# EAGLE design USB_DebugCable (EAGLE 6.4)
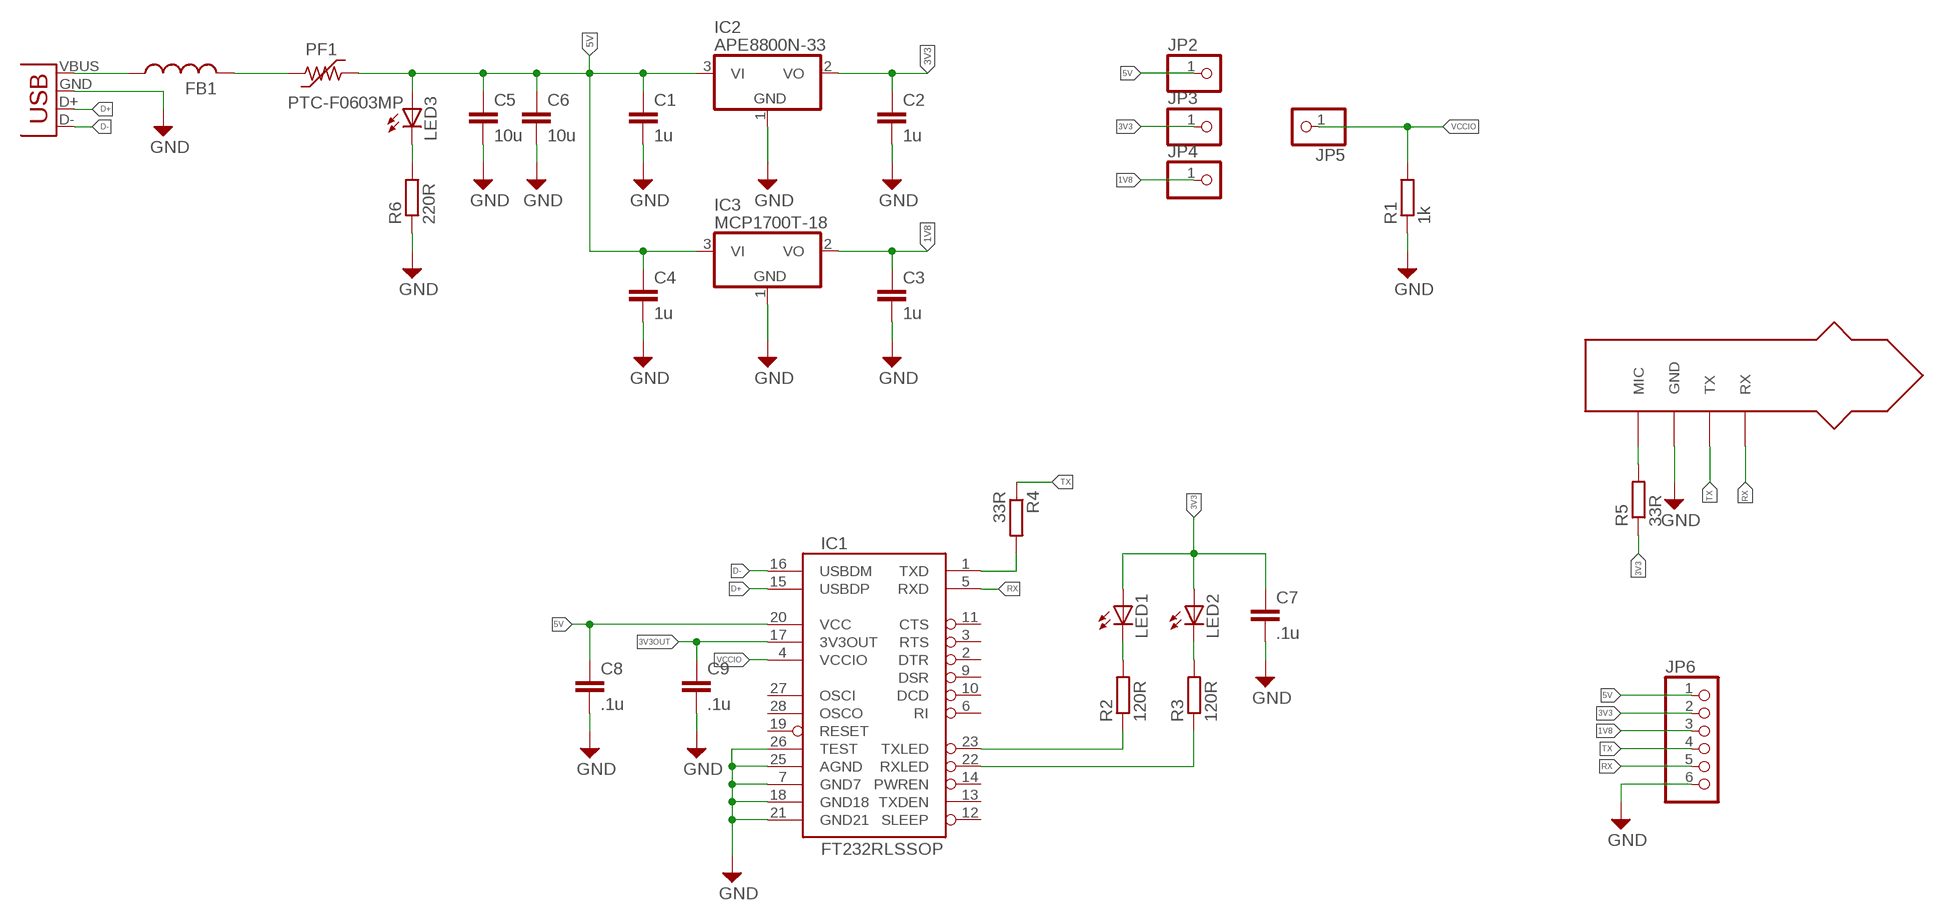
[diagram p0: schematic, sheet 1]

## Parts
C1  1u  C-EUC0603K  [C0603K]
C2  1u  C-EUC0603K  [C0603K]
C3  1u  C-EUC0603K  [C0603K]
C4  1u  C-EUC0603K  [C0603K]
C5  10u  C-EUC0603K  [C0603K]
C6  10u  C-EUC0603K  [C0603K]
C7  .1u  C-EUC0603K  [C0603K]
C8  .1u  C-EUC0402K  [C0402K]
C9  .1u  C-EUC0402K  [C0402K]
FB1  FERRITE-BEADA  [0603]
IC1  FT232RLSSOP  [SSOP28DB]
IC2  APE8800N-33  MCP1703CB  [SOT23]
IC3  MCP1700T-18  MCP1703CB  [SOT23]
JP1  USB-A-H  [USB-A-H]
JP2  PINHD-1X1  [1X01]
JP3  PINHD-1X1  [1X01]
JP4  PINHD-1X1  [1X01]
JP5  PINHD-1X1  [1X01]
JP6  PINHD-1X6CB  [1X06-CLEANBIG]
LED1  LEDCHIPLED_0603  [CHIPLED_0603]
LED2  LEDCHIPLED_0603  [CHIPLED_0603]
LED3  LEDCHIPLED_0603  [CHIPLED_0603]
PF1  PTC-F0603MP  [F0603MP]
R1  1k  R-EU_R0603  [R0603]
R2  120R  R-EU_R0603  [R0603]
R3  120R  R-EU_R0603  [R0603]
R4  33R  R-EU_R0603  [R0603]
R5  33R  R-EU_R0603  [R0603]
R6  220R  R-EU_R0603  [R0603]
U$1  JACK3.5_4  [3.5MM4]

## Nets
1V8: C3.1 IC3.2(VO) JP4.1 JP6.3
3V3: C2.1 C7.1 IC2.2(VO) JP3.1 JP6.2 LED1.A LED2.A R5.1
3V3OUT: C9.1 IC1.17(3V3OUT)
5V: C1.1 C4.1 C5.1 C6.1 C8.1 IC1.20(VCC) IC2.3(VI) IC3.3(VI) JP2.1 JP6.1 LED3.A PF1.2
D+: IC1.15(USBDP) JP1.D+(D-)
D-: IC1.16(USBDM) JP1.D-(D+)
GND: C1.2 C2.2 C3.2 C4.2 C5.2 C6.2 C7.2 C8.2 C9.2 IC1.7(GND7) IC1.18(GND18) IC1.21(GND21) IC1.25(AGND) IC1.26(TEST) IC2.1(GND) IC3.1(GND) JP1.GND(VBUS) JP6.6 R1.1 R6.1 U$1.GND
N$1: FB1.1 JP1.VBUS(GND)
N$2: R5.2 U$1.MIC_1(MIC) U$1.MIC_2(MIC)
N$3: IC1.1(TXD) R4.2
N$4: FB1.2 PF1.1
N$5: IC1.23(TXLED) R2.1
N$6: IC1.22(RXLED) R3.1
N$7: LED1.C R2.2
N$8: LED2.C R3.2
N$9: LED3.C R6.2
RX: IC1.5(RXD) JP6.5 U$1.RX_1(RX) U$1.RX_2(RX)
TX: JP6.4 R4.1 U$1.TX
VCCIO: IC1.4(VCCIO) JP5.1 R1.2
Unconnected: IC1.2(DTR) IC1.3(RTS) IC1.6(RI) IC1.9(DSR) IC1.10(DCD) IC1.11(CTS) IC1.12(SLEEP) IC1.13(TXDEN) IC1.14(PWREN) IC1.19(RESET) IC1.27(OSCI) IC1.28(OSCO)

## Library data of the parts
C1-C9 = rcl-2:C-EU: CAPACITOR, European symbol
FB1 = m-pad-2.1:FERRITE-BEAD: Ferrite beads in various packages
IC1 = SparkFun:FT232RL: USB UART FT232RL 4th Generation USB UART (USB <-> Serial) Controller. Spark Fun Electronics SKU : COM-00650
IC2 IC3 = linear:MCP1703: 250 mA, 16V, Low Quiescent Current LDO Regulator Source: http://ww1.microchip.com/downloads/en/DeviceDoc/22049b.pdf
JP1 = SparkFun-Connectors:USB: USB Connectors USB-B-PTH is fully proven SKU : PRT-00139/CONN-08278 USB-miniB is fully proven SKU : PRT-00587 USB-A-PCB is untested. USB-A-H is throughly reviewed, but untested. Spark Fun Electronics SKU : PRT-00437 USB-B-SMT is throughly reviewed, but untested. Needs silkscreen touching up. USB-A-S has not been used/tested USB-MB-H has not been used/tested USB-MICROB has been used. CONN-09505
JP2-JP5 = adafruit:PINHD-1X1: Pin header 1x1 for 0.1" spacing With round pins
JP6 = adafruit:PINHD-1X6: PIN HEADER
LED1-LED3 = adafruit:LED: LED OSRAM: - CHIPLED LG R971, LG N971, LY N971, LG Q971, LY Q971, LO R971, LY R971 LH N974, LH R974 LS Q976, LO Q976, LY Q976 LO Q996 - Hyper CHIPLED LW Q18S LB Q993, LB Q99A, LB R99A - SideLED LS A670, LO A670, LY A670, LG A670, LP A670 LB A673, LV A673, LT A673, LW A673 LH A674 LY A675 LS A676, LA A676, LO A676, LY A676, LW A676 LS A679, LY A679, LG A679 - Hyper Micro SIDELED® LS Y876, LA Y876, LO Y876, LY Y876 LT Y87S - SmartLED LW L88C, LW L88S LB L89C, LB L89S, LG L890 LS L89K, LO L89K, LY L89K LS L896, LA L896, LO L896, LY L896 - TOPLED LS T670, LO T670, LY T670, LG T670, LP T670 LSG T670, LSP T670, LSY T670, LOP T670, LYG T670 LG T671, LOG T671, LSG T671 LB T673, LV T673, LT T673, LW T673 LH T674 LS T676, LA T676, LO T676, LY T676, LB T676, LH T676, LSB T676, LW T676 LB T67C, LV T67C, LT T67C, LS T67K, LO T67K, LY T67K, LW E67C LS E67B, LA E67B, LO E67B, LY E67B, LB E67C, LV E67C, LT E67C LW T67C LS T679, LY T679, LG T679 LS T770, LO T770, LY T770, LG T770, LP T770 LB T773, LV T773, LT T773, LW T773 LH T774 LS E675, LA E675, LY E675, LS T675 LS T776, LA T776, LO T776, LY T776, LB T776 LHGB T686 LT T68C, LB T68C - Hyper Mini TOPLED® LB M676 - Mini TOPLED Santana® LG M470 LS M47K, LO M47K, LY M47K Source: http://www.osram.convergy.de/
PF1 = polyswitch:PTC-: POLYSWITCH Polyswitch Resetable Fuses
R1-R6 = rcl-2:R-EU_: RESISTOR, European symbol
U$1 = jack_35_4:JACK3.5_4

## Board
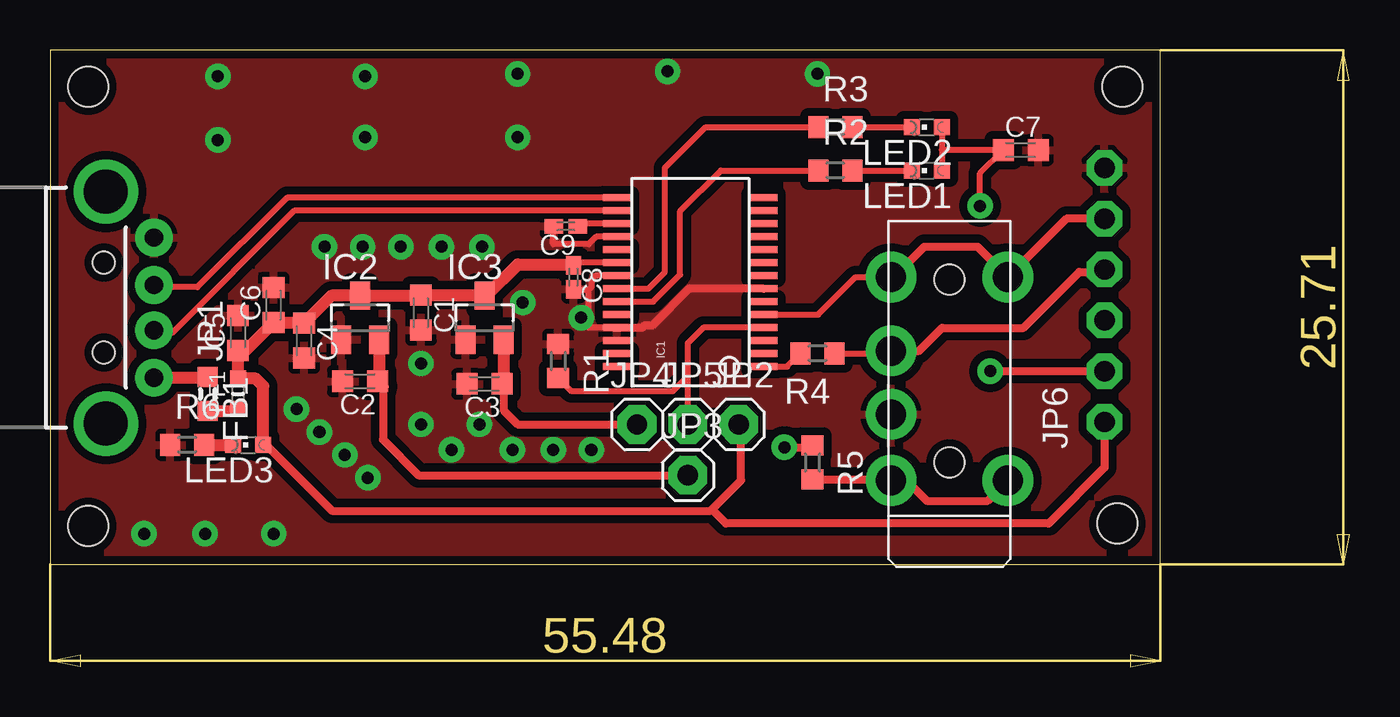
[diagram p1: board, top side]
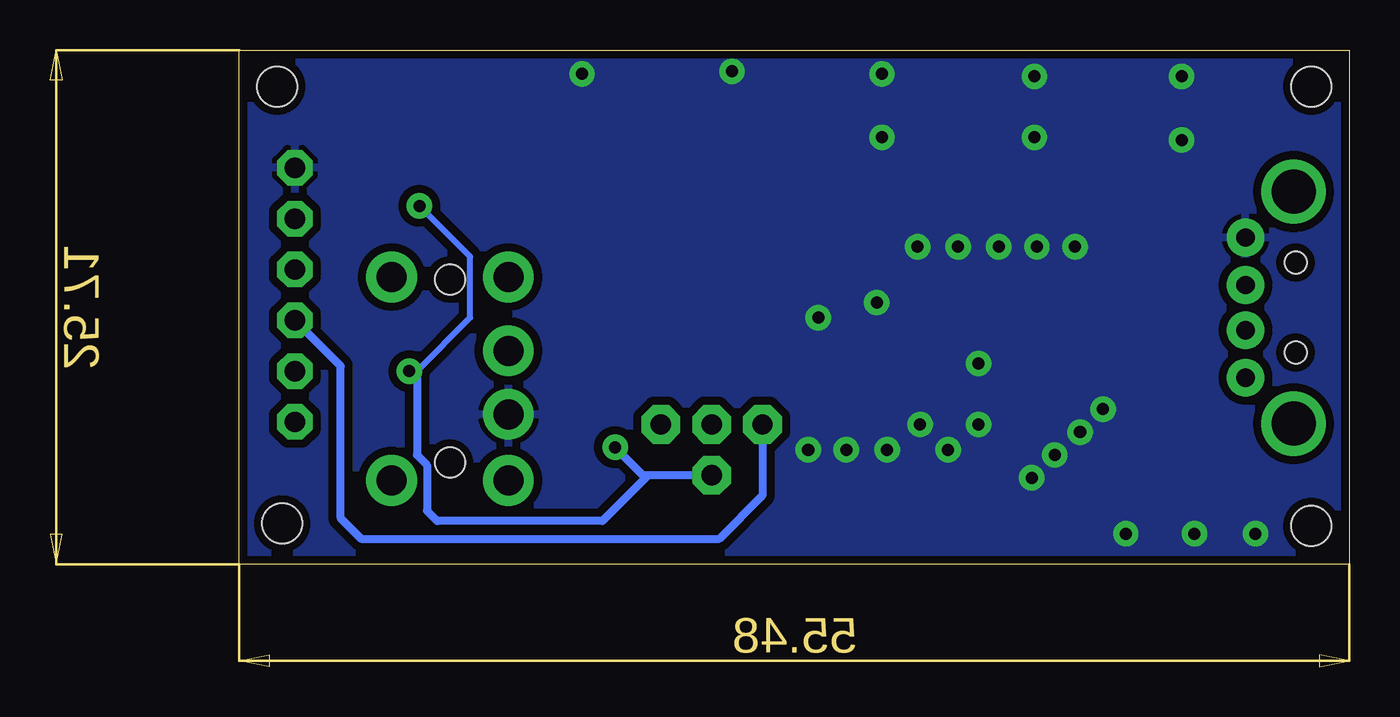
[diagram p2: board, bottom side, seen from below]

Size 55.48 x 25.71 mm. Coordinates in mm from the lower left corner, seen from the top.
Outline: 0,0 55.48,0 55.48,25.71 0,25.71 0,0
Copper layers (1*16): Top 0.0356mm / dielectric 1.5011mm / Bottom 0.0356mm
Design rules "InGear": minimum track width 10mil, minimum drill 0.5mm, track to track 10mil, track to pad 10mil, pad to pad 10mil, via to via 12mil, smd to smd 0mil, copper to edge 15mil, drill to drill 15mil, minimum pad ring 7mil, minimum via ring 7mil, stop-mask expansion 4mil, vias tented up to drill 0mil, thermal gap 10mil
Holes 2 mm at 1.91,23.88 53.59,23.88 53.34,2.03 1.91,1.91

### Footprints (pad centres in the part's own frame; a part is rotated, then mirrored left to right if it is on the bottom)
C0603K = smd 1.05 x 1.08: 1 -0.875,0; 2 0.875,0
C0402K = smd 0.925 x 0.74: 1 -0.6,0; 2 0.6,0
0603 = smd 1 x 1: 1 -0.85,0; 2 0.85,0
SSOP28DB = smd 0.348 x 1.397: 1 -4.225,-3.656; 2 -3.575,-3.656; 3 -2.925,-3.656; 4 -2.275,-3.656; 5 -1.625,-3.656; 6 -0.975,-3.656; 7 -0.325,-3.656; 8 0.325,-3.656; 9 0.975,-3.656; 10 1.625,-3.656; 11 2.275,-3.656; 12 2.925,-3.656; 13 3.575,-3.656; 14 4.225,-3.656; 15 4.225,3.656; 16 3.575,3.656; 17 2.925,3.656; 18 2.275,3.656; 19 1.625,3.656; 20 0.975,3.656; 21 0.325,3.656; 22 -0.325,3.656; 23 -0.975,3.656; 24 -1.625,3.656; 25 -2.275,3.656; 26 -2.925,3.656; 27 -3.575,3.656; 28 -4.225,3.656
SOT23 = smd 1 x 1.4: 1 -0.95,-1.1; 2 0.95,-1.1; 3 0,1.1
USB-A-H = drill 0.914 pad 1.88: D+ 2.4,1.127; D- 2.4,-1.127; GND 2.4,3.5; VBUS 2.4,-3.5 | drill 2.2: GND2 0,-5.8; GND3 0,5.8 | hole 1.1: -0.1,2.25; -0.1,-2.25
1X01 = drill 1.016 pad 1.93 octagon: 1 0,0
1X06-CLEANBIG = drill 1.016 pad 1.778 octagon: 1 -6.35,0; 2 -3.81,0; 3 -1.27,0; 4 1.27,0; 5 3.81,0; 6 6.35,0
CHIPLED_0603 = smd 0.8 x 0.8: A 0,-0.75; C 0,0.75
F0603MP = smd 0.8 x 0.8: 1 -0.762,0; 2 0.762,0
R0603 = smd 1 x 1.1: 1 -0.85,0; 2 0.85,0
3.5MM4 = drill 1.5 pad 2.54: GND 8.382,9.398; MIC_1 2.54,12.7; MIC_2 8.382,12.7; RX_1 2.54,2.54; RX_2 8.382,2.54; TX 8.382,6.223 | hole 1.5: 5.461,11.811; 5.461,2.667

### Placement (x,y rotation side)
C1  18.54,12.57 270 top
C2  15.49,9.14 180 top
C3  21.72,9.02 180 top
C4  12.7,11.18 270 top
C5  9.4,11.56 90 top
C6  11.18,12.95 90 top
C7  48.51,20.7 0 top
C8  26.16,14.35 270 top
C9  25.78,16.89 180 top
FB1  7.87,8.51 270 top
IC1  32,14.1 90 top
IC2  15.49,12.32 0 top
IC3  21.72,12.32 0 top
JP1  2.79,12.83 0 top
JP2  34.42,6.98 0 top
JP3  31.88,4.45 0 top
JP4  29.34,6.98 0 top
JP5  31.88,6.98 0 top
JP6  52.71,13.46 90 top
LED1  43.82,19.69 90 top
LED2  43.82,21.84 90 top
LED3  9.91,5.97 90 top
PF1  9.4,8.51 90 top
R1  25.4,10.16 270 top
R2  39.24,19.69 0 top
R3  39.24,21.84 0 top
R4  38.35,10.54 180 top
R5  38.1,5.08 270 top
R6  6.86,5.97 0 top
U$1  50.42,16.89 180 top

### Tracks (layer width: path | path; a pad name or v marks a point on that pad's centre or on a via)
1V8
  Top 0.406: 22.67,9.09 22.67,7.69 23.37,6.98 JP4.1
  Top 0.61: IC3.2 22.67,9.09 C3.1 22.61,9
  Bottom 0.406: JP4.1 29.34,3.43 31.5,1.27 49.4,1.27 50.42,2.29 50.42,9.91 JP6.3
3V3  (via drill 0.6 pad 1.27)
  Top 0.305: v46.48,17.91 46.48,19.54 C7.1 44.57,20.7 | LED2.A 44.57,20.7 | 44.57,20.7 LED1.A
  Top 0.406: 16.64,8.88 16.64,6.22 18.41,4.45 JP3.1 | v36.7,5.84 38.01,5.84 R5.1 | v46.99,9.65 JP6.2
  Top 0.61: IC2.2 16.44,9.22 C2.1 16.64,8.88
  Bottom 0.305: v46.99,9.65 46.61,9.65 43.94,12.32 43.94,15.37 v46.48,17.91
  Bottom 0.406: JP3.1 35.05,4.45 | 35.05,4.45 35.31,4.45 v36.7,5.84 | 35.05,4.45 37.34,2.16 45.59,2.16 46.1,2.67 46.1,4.95 46.61,5.46 46.61,9.65
3V3OUT
  Top 0.305: IC1.17 26.51,17.02 C9.1
5V
  Top 0.305: IC1.20 26.28,15.07 C8.1
  Top 0.406: LED3.A 10.8,5.97 14.1,2.67 33.02,2.67 33.08,2.73 | 33.08,2.73 34.54,4.19 34.54,6.86 JP2.1 | JP6.1 52.71,4.83 49.91,2.03 33.78,2.03 33.08,2.73
  Top 0.61: C8.1 26.13,14.99 23.37,14.99 21.8,13.42 IC3.3 21.69,13.45 C1.1 18.51,13.42 IC2.3 14.07,13.42 C4.1 12.67,12.08 C6.1 9.78,10.68 C5.1 PF1.2 10.29,9.27 10.66,8.9 LED3.A
D+
  Top 0.305: IC1.15 11.84,18.32 7.37,13.84 5.3,13.84 JP1.D+
D-
  Top 0.305: IC1.16 12.21,17.67 6.1,11.56 5.34,11.56 JP1.D-
GND  (via drill 0.6 pad 1.27)
  Top 0.305: IC1.18 27.29,16.37 26.92,16 25.15,16 25.15,16.86 C9.2 | IC1.21 27.25,14.42 27.05,14.22 27.05,13.84 26.92,13.72 | 26.92,13.72 26.2,13.72 C8.2 | IC1.25 28.18,11.82 26.93,11.82 26.92,11.81 26.92,13.72
  Top 0.406: 28.18,11.82 29.58,11.82 29.59,11.81 29.72,11.94 30.1,11.94 31.93,13.77 IC1.7
  other vias: 13.72,15.88 15.62,15.88 17.53,15.88 19.56,15.88 21.59,15.88 23.62,13.08 26.54,12.32 18.54,10.03 18.54,6.98 21.46,6.98 23.11,5.71 25.15,5.71 27.05,5.71 8.38,24.38 15.75,24.38 23.37,24.51 30.86,24.64 38.35,24.51 8.38,21.21 15.75,21.34 23.37,21.34 4.7,1.52 7.75,1.52 11.18,1.52 12.32,7.75 13.46,6.6 14.73,5.46 15.88,4.32 20.07,5.71
  pour Top (isolate 0.406): 0.25,-16.89 160.27,-16.89 160.53,100.71 0.51,100.71
  pour Bottom (isolate 0.406): 0.25,-16.89 0.25,100.71 160.53,100.71 160.53,-16.89
N$1
  Top 0.61: JP1.VBUS 7.87,9.33 FB1.1
N$2
  Top 0.406: R5.2 42,4.23 U$1.MIC_2 42.8,4.19 43.82,3.17 46.86,3.17 U$1.MIC_1
N$3
  Top 0.305: IC1.1 36.84,9.87 R4.2
N$4
  Top 0.61: FB1.2 9.4,7.66 PF1.1
N$5
  Top 0.305: IC1.23 30.14,13.12 31.5,14.48 31.5,17.65 33.53,19.69 R2.1
N$6
  Top 0.305: IC1.22 29.9,13.77 30.73,14.61 30.73,19.81 32.77,21.84 R3.1
N$7
  Top 0.305: R2.2 LED1.C
N$8
  Top 0.305: R3.2 LED2.C
N$9
  Top 0.61: R6.2 LED3.C
RX
  Top 0.305: IC1.5 38.38,12.47 40.26,14.35 U$1.RX_2
  Top 0.406: JP6.5 50.8,17.27 U$1.RX_1 46.36,15.88 43.69,15.88 42.16,14.35 U$1.RX_2
TX
  Top 0.305: R4.1 41.91,10.54 U$1.TX
  Top 0.406: JP6.4 52.58,14.61 51.44,14.61 48.64,11.81 44.58,11.81 43.43,10.67 U$1.TX
VCCIO
  Top 0.305: IC1.4 32.65,11.82 31.88,11.05 31.88,9.4 | JP5.1 31.88,9.4 | 31.88,9.4 31.11,8.64 26.07,8.64 R1.2